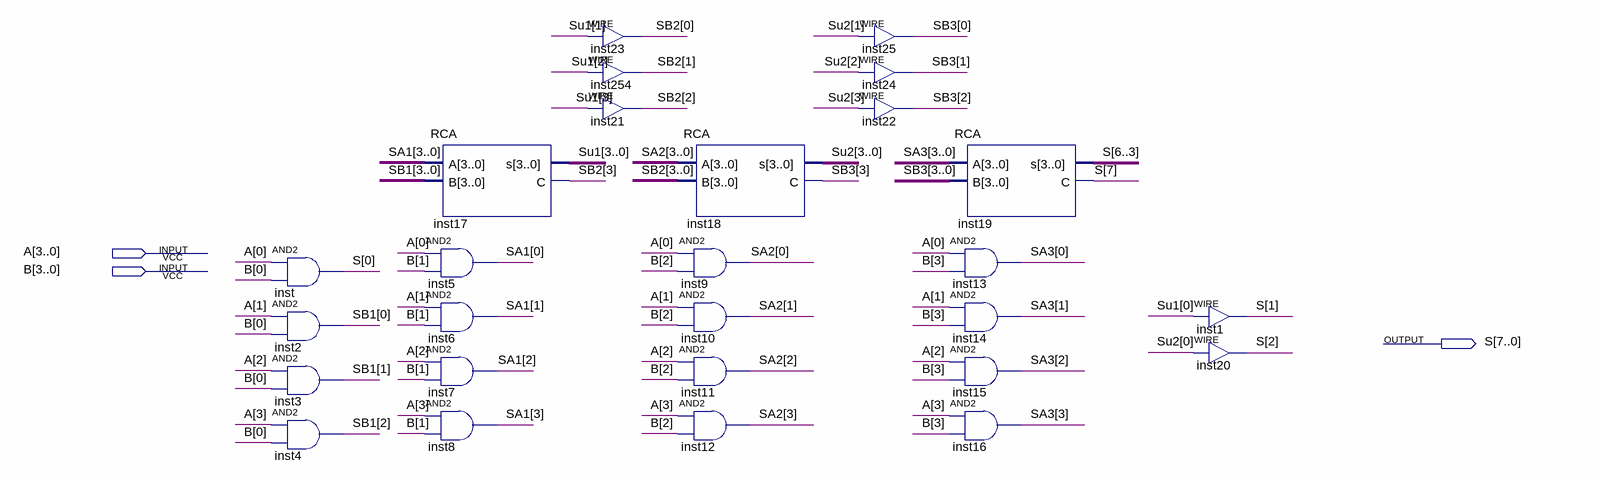
[diagram p0: schematic sheet]
// Quartus schematic Multi.bdf as structural Verilog: 27 symbols, 3 pins
module Multi (
  input  [3:0] A,
  input  [3:0] B,
  output [7:0] S
);

  wire [3:0] SA1, SA2, SA3, SB1, SB2, SB3, Su1, Su2;

  and inst (S[0], A[0], B[0]);
  and inst2 (SB1[0], A[1], B[0]);
  and inst3 (SB1[1], A[2], B[0]);
  and inst4 (SB1[2], A[3], B[0]);
  RCA inst17 (.A(SA1), .B(SB1), .s(Su1), .C(SB2[3]));
  and inst5 (SA1[0], A[0], B[1]);
  and inst6 (SA1[1], A[1], B[1]);
  and inst7 (SA1[2], A[2], B[1]);
  and inst8 (SA1[3], A[3], B[1]);
  assign SB2[0] = Su1[1];  // WIRE inst23
  assign SB2[1] = Su1[2];  // WIRE inst254
  assign SB2[2] = Su1[3];  // WIRE inst21
  RCA inst18 (.A(SA2), .B(SB2), .s(Su2), .C(SB3[3]));
  and inst9 (SA2[0], A[0], B[2]);
  and inst10 (SA2[1], A[1], B[2]);
  and inst11 (SA2[2], A[2], B[2]);
  and inst12 (SA2[3], A[3], B[2]);
  assign SB3[0] = Su2[1];  // WIRE inst25
  assign SB3[1] = Su2[2];  // WIRE inst24
  assign SB3[2] = Su2[3];  // WIRE inst22
  RCA inst19 (.A(SA3), .B(SB3), .s(S[6:3]), .C(S[7]));
  and inst13 (SA3[0], A[0], B[3]);
  and inst14 (SA3[1], A[1], B[3]);
  and inst15 (SA3[2], A[2], B[3]);
  and inst16 (SA3[3], A[3], B[3]);
  assign S[1] = Su1[0];  // WIRE inst1
  assign S[2] = Su2[0];  // WIRE inst20
endmodule
